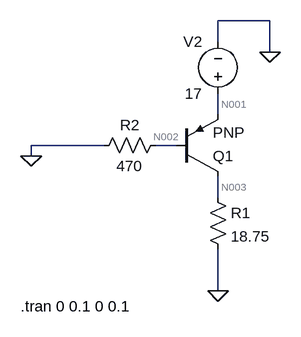
[diagram p0: schematic EJ3.asc]
EJ3.asc, the LTspice schematic file:
Version 4
SHEET 1 880 680
WIRE 336 -176 256 -176
WIRE 256 -144 256 -176
WIRE 336 -128 336 -176
WIRE 256 -32 256 -64
WIRE 80 16 -32 16
WIRE 192 16 160 16
WIRE -32 32 -32 16
WIRE 256 96 256 64
WIRE 256 240 256 176
FLAG 256 240 0
FLAG -32 32 0
FLAG 336 -128 0
SYMBOL res 240 80 R0
SYMATTR InstName R1
SYMATTR Value 18.75
SYMBOL res 64 32 R270
WINDOW 0 32 56 VTop 2
WINDOW 3 0 56 VBottom 2
SYMATTR InstName R2
SYMATTR Value 470
SYMBOL voltage 256 -48 R180
WINDOW 0 24 96 Left 2
WINDOW 3 24 16 Left 2
WINDOW 123 0 0 Left 0
WINDOW 39 0 0 Left 0
SYMATTR InstName V2
SYMATTR Value 17
SYMBOL pnp 192 64 M180
SYMATTR InstName Q1
TEXT -48 264 Left 2 !.tran 0 0.1 0 0.1

The netlist it stands for:
* EJ3.asc
R1 N003 0 18.75
R2 0 N002 470
V2 N001 0 17
Q1 N003 N002 N001 0 PNP
.model NPN NPN
.model PNP PNP
.lib standard.bjt
.tran 0 0.1 0 0.1
.backanno
.end

* Results of the author's LTspice run, read from the files saved beside the schematic
* Operating Point, zero values left out:
*   V(n003) = 16.91 V
*   V(n002) = 16.05 V
*   V(n001) = 17 V
*   Ic(Q1) = -901.6 mA
*   Ib(Q1) = -34.15 mA
*   Ie(Q1) = 935.8 mA
*   I(R1) = 901.6 mA
*   I(R2) = -34.15 mA
*   I(V2) = -935.8 mA
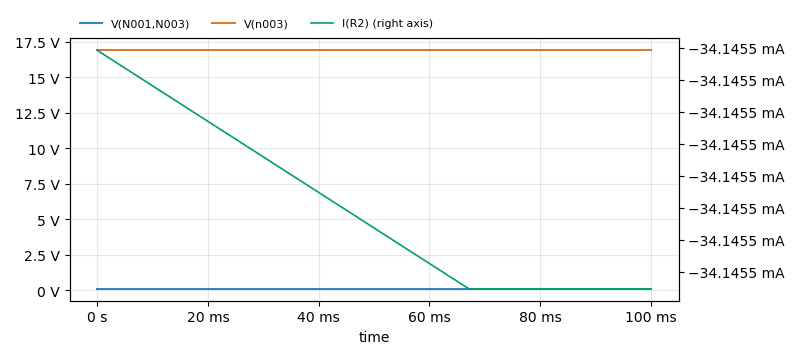
[diagram p1: Transient Analysis of EJ3.asc, plotted from the saved traces]
* Transient Analysis, 1 run:
*   V(N001,N003): min 94.49 mV, max 94.49 mV, average 94.49 mV, rms 94.49 mV, last 94.49 mV
*   V(n003): min 16.91 V, max 16.91 V, average 16.91 V, rms 16.91 V, last 16.91 V
*   I(R2): min -34.15 mA, max -34.15 mA, average -34.15 mA, rms 34.15 mA, last -34.15 mA